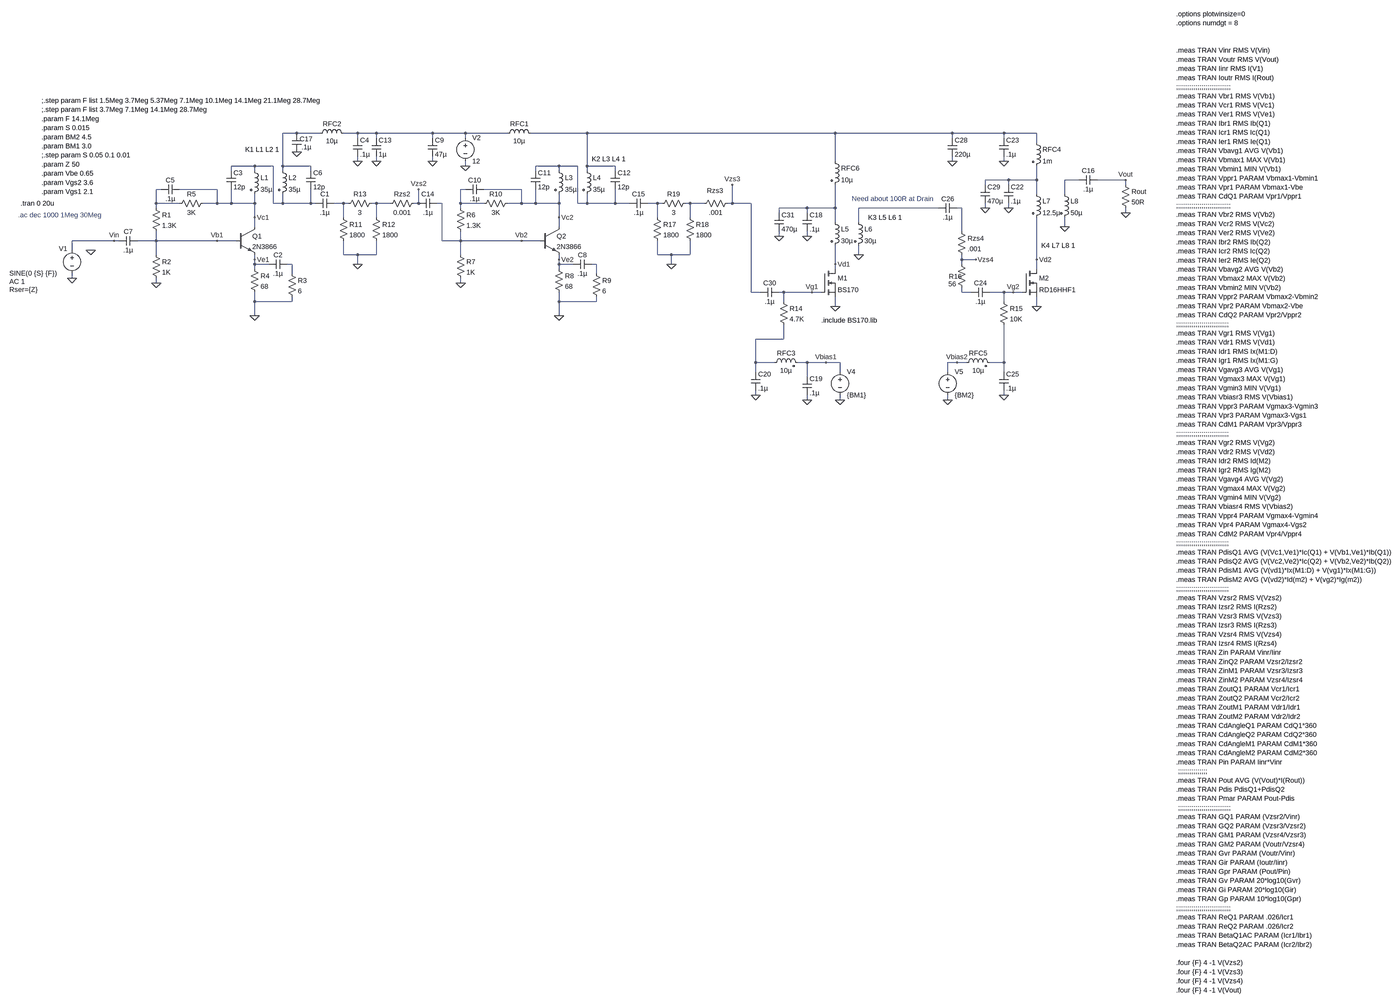
[diagram p0: schematic 2N3866 x2 EMRFD BS170 RD16HHF1.asc, whole sheet]
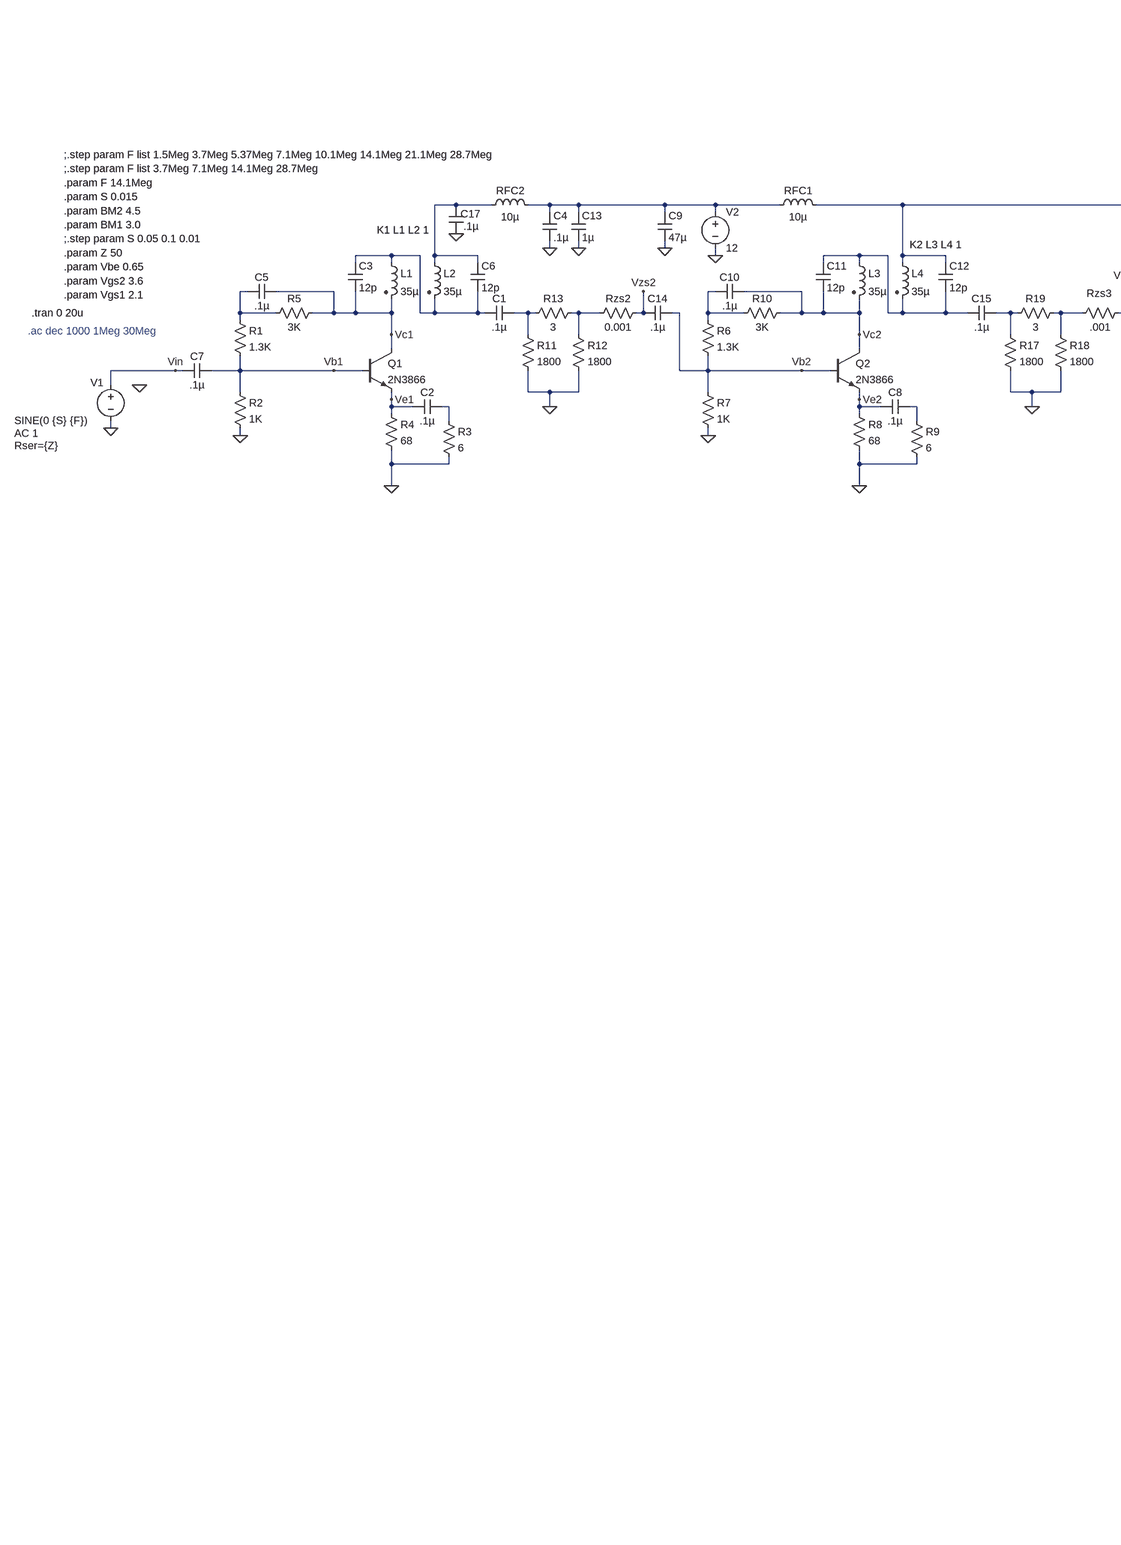
[diagram p1: schematic 2N3866 x2 EMRFD BS170 RD16HHF1.asc, part, row 1 of 1, column 1 of 2]
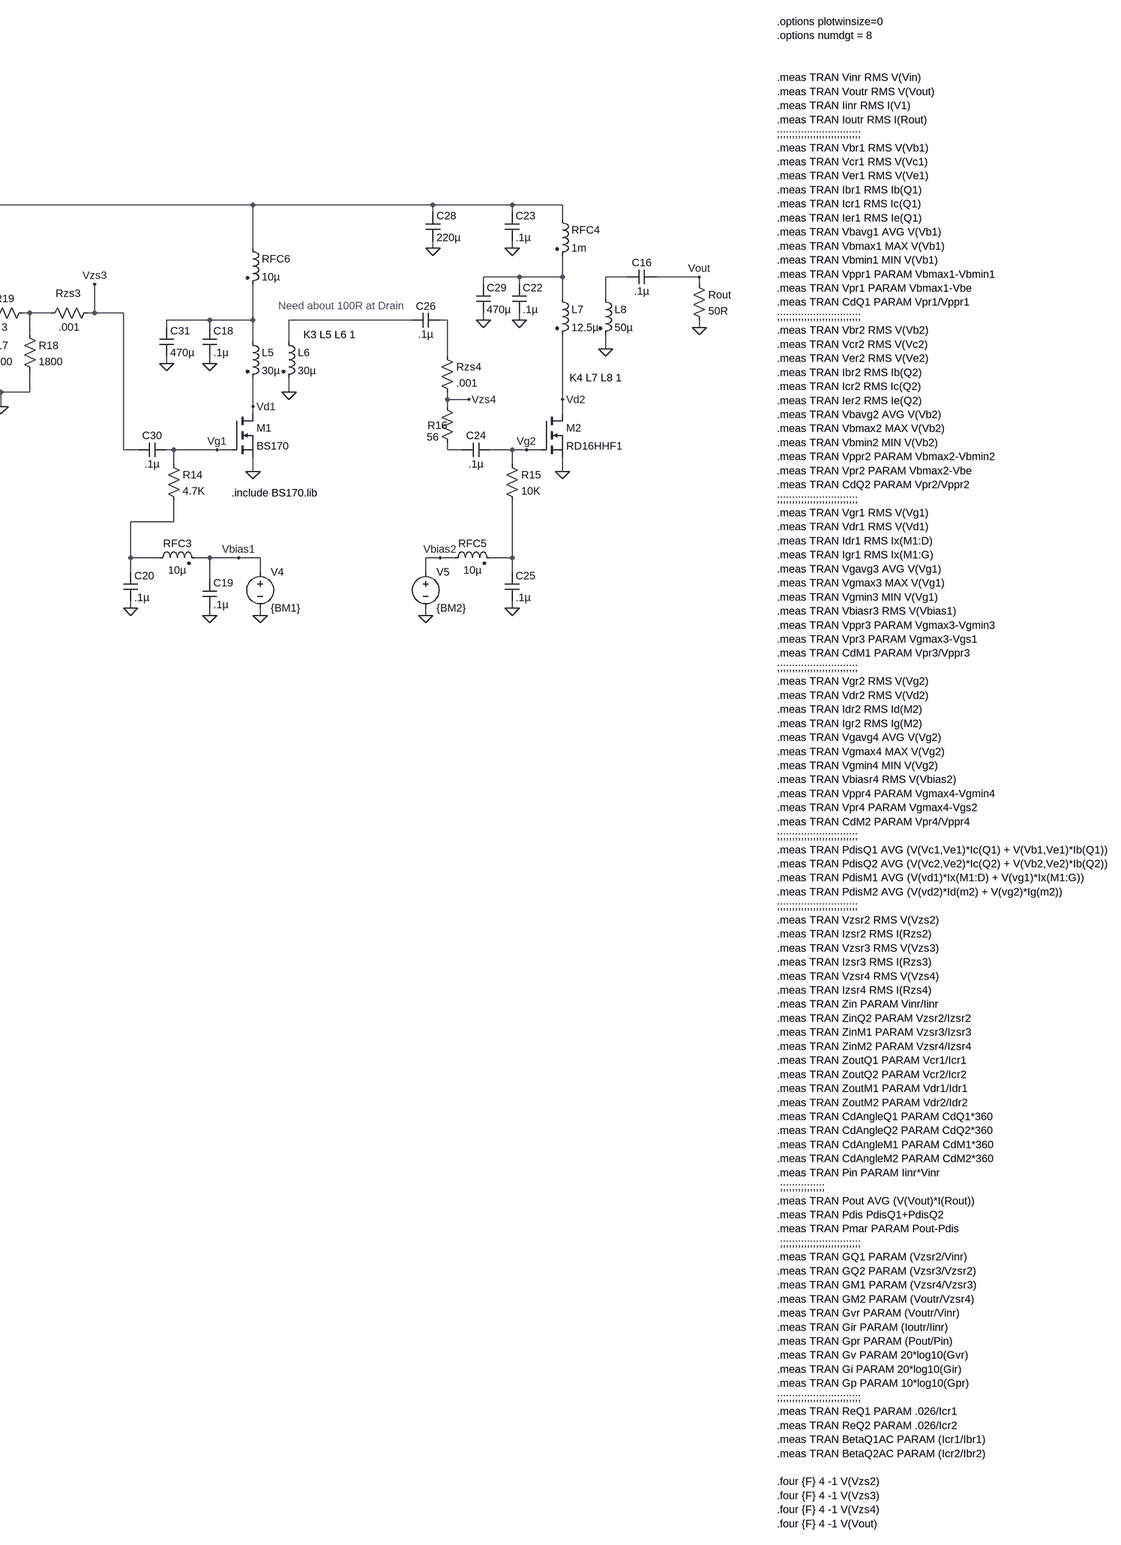
[diagram p2: schematic 2N3866 x2 EMRFD BS170 RD16HHF1.asc, part, row 1 of 1, column 2 of 2]
2N3866 x2 EMRFD BS170 RD16HHF1.asc, the LTspice schematic file:
Version 4
SHEET 1 5068 2428
WIRE 560 -176 512 -176
WIRE 640 -176 560 -176
WIRE 768 -176 720 -176
WIRE 832 -176 768 -176
WIRE 1024 -176 832 -176
WIRE 1136 -176 1024 -176
WIRE 1280 -176 1136 -176
WIRE 1552 -176 1360 -176
WIRE 2400 -176 1552 -176
WIRE 2800 -176 2400 -176
WIRE 2976 -176 2800 -176
WIRE 3088 -176 2976 -176
WIRE 768 -160 768 -176
WIRE 832 -160 832 -176
WIRE 1024 -160 1024 -176
WIRE 1136 -160 1136 -176
WIRE 2800 -160 2800 -176
WIRE 2976 -160 2976 -176
WIRE 3088 -144 3088 -176
WIRE 768 -80 768 -96
WIRE 832 -80 832 -96
WIRE 1024 -80 1024 -96
WIRE 2400 -80 2400 -176
WIRE 2800 -80 2800 -96
WIRE 2976 -80 2976 -96
WIRE 416 -64 336 -64
WIRE 480 -64 416 -64
WIRE 512 -64 512 -176
WIRE 608 -64 512 -64
WIRE 1136 -64 1136 -80
WIRE 1456 -64 1376 -64
WIRE 1520 -64 1456 -64
WIRE 1552 -64 1552 -176
WIRE 1648 -64 1552 -64
WIRE 336 -48 336 -64
WIRE 416 -48 416 -64
WIRE 512 -48 512 -64
WIRE 608 -48 608 -64
WIRE 1376 -48 1376 -64
WIRE 1456 -48 1456 -64
WIRE 1552 -48 1552 -64
WIRE 1648 -48 1648 -64
WIRE 2992 -16 2912 -16
WIRE 3088 -16 3088 -64
WIRE 3088 -16 2992 -16
WIRE 3232 -16 3184 -16
WIRE 3392 -16 3296 -16
WIRE 2912 0 2912 -16
WIRE 2992 0 2992 -16
WIRE 3392 0 3392 -16
WIRE 96 16 80 16
WIRE 288 16 160 16
WIRE 1136 16 1120 16
WIRE 1328 16 1200 16
WIRE 3088 32 3088 -16
WIRE 3184 32 3184 -16
WIRE 80 64 80 16
WIRE 160 64 80 64
WIRE 288 64 288 16
WIRE 288 64 240 64
WIRE 336 64 336 16
WIRE 336 64 288 64
WIRE 416 64 416 32
WIRE 416 64 336 64
WIRE 480 64 480 -64
WIRE 512 64 512 32
WIRE 512 64 480 64
WIRE 608 64 608 16
WIRE 608 64 512 64
WIRE 624 64 608 64
WIRE 720 64 688 64
WIRE 736 64 720 64
WIRE 832 64 816 64
WIRE 880 64 832 64
WIRE 976 64 976 16
WIRE 976 64 960 64
WIRE 1056 64 1040 64
WIRE 1120 64 1120 16
WIRE 1200 64 1120 64
WIRE 1328 64 1328 16
WIRE 1328 64 1280 64
WIRE 1376 64 1376 16
WIRE 1376 64 1328 64
WIRE 1456 64 1456 32
WIRE 1456 64 1376 64
WIRE 1520 64 1520 -64
WIRE 1552 64 1552 32
WIRE 1552 64 1520 64
WIRE 1648 64 1648 16
WIRE 1648 64 1552 64
WIRE 1696 64 1648 64
WIRE 1792 64 1760 64
WIRE 1808 64 1792 64
WIRE 1904 64 1888 64
WIRE 1952 64 1904 64
WIRE 2048 64 2048 0
WIRE 2048 64 2032 64
WIRE 2112 64 2048 64
WIRE 80 80 80 64
WIRE 1120 80 1120 64
WIRE 2304 80 2208 80
WIRE 2400 80 2400 0
WIRE 2400 80 2304 80
WIRE 2752 80 2480 80
WIRE 2832 80 2816 80
WIRE 2912 80 2912 64
WIRE 2992 80 2992 64
WIRE 2208 96 2208 80
WIRE 2304 96 2304 80
WIRE 3392 96 3392 80
WIRE 416 112 416 64
WIRE 720 112 720 64
WIRE 832 112 832 64
WIRE 1456 112 1456 64
WIRE 1792 112 1792 64
WIRE 1904 112 1904 64
WIRE 2400 128 2400 80
WIRE 2480 128 2480 80
WIRE 416 144 416 112
WIRE 1456 144 1456 112
WIRE 3184 144 3184 112
WIRE 2832 160 2832 80
WIRE 2208 176 2208 160
WIRE 2304 176 2304 160
WIRE -64 192 -208 192
WIRE -48 192 -64 192
WIRE 80 192 80 160
WIRE 80 192 16 192
WIRE 288 192 80 192
WIRE 352 192 288 192
WIRE 1056 192 1056 64
WIRE 1120 192 1120 160
WIRE 1120 192 1056 192
WIRE 1328 192 1120 192
WIRE 1392 192 1328 192
WIRE -208 224 -208 192
WIRE 80 240 80 192
WIRE 720 240 720 192
WIRE 768 240 720 240
WIRE 832 240 832 192
WIRE 832 240 768 240
WIRE 1120 240 1120 192
WIRE 1792 240 1792 192
WIRE 1840 240 1792 240
WIRE 1904 240 1904 192
WIRE 1904 240 1840 240
WIRE 2480 240 2480 208
WIRE 416 256 416 240
WIRE 1456 256 1456 240
WIRE 2832 256 2832 240
WIRE 2880 256 2832 256
WIRE 3088 256 3088 112
WIRE 416 272 416 256
WIRE 464 272 416 272
WIRE 544 272 528 272
WIRE 768 272 768 240
WIRE 1456 272 1456 256
WIRE 1504 272 1456 272
WIRE 1584 272 1568 272
WIRE 1840 272 1840 240
WIRE 2400 272 2400 208
WIRE 2832 272 2832 256
WIRE 416 288 416 272
WIRE 1456 288 1456 272
WIRE 2400 288 2400 272
WIRE 3088 288 3088 256
WIRE 544 304 544 272
WIRE 1584 304 1584 272
WIRE -208 320 -208 304
WIRE 80 336 80 320
WIRE 1120 336 1120 320
WIRE 2112 368 2112 64
WIRE 2144 368 2112 368
WIRE 2224 368 2208 368
WIRE 2320 368 2224 368
WIRE 2352 368 2320 368
WIRE 2832 368 2832 352
WIRE 2864 368 2832 368
WIRE 2976 368 2928 368
WIRE 3008 368 2976 368
WIRE 3040 368 3008 368
WIRE 416 400 416 368
WIRE 544 400 544 384
WIRE 544 400 416 400
WIRE 1456 400 1456 368
WIRE 1584 400 1584 384
WIRE 1584 400 1456 400
WIRE 2224 400 2224 368
WIRE 2976 400 2976 368
WIRE 2400 416 2400 384
WIRE 3088 416 3088 384
WIRE 416 448 416 400
WIRE 1456 448 1456 400
WIRE 2224 528 2224 480
WIRE 2224 528 2128 528
WIRE 2128 608 2128 528
WIRE 2192 608 2128 608
WIRE 2304 608 2272 608
WIRE 2368 608 2304 608
WIRE 2416 608 2368 608
WIRE 2816 608 2784 608
WIRE 2848 608 2816 608
WIRE 2976 608 2976 480
WIRE 2976 608 2928 608
WIRE 2128 640 2128 608
WIRE 2416 640 2416 608
WIRE 2784 640 2784 608
WIRE 2976 640 2976 608
WIRE 2304 656 2304 608
WIRE 2128 720 2128 704
WIRE 2976 720 2976 704
WIRE 2304 736 2304 720
WIRE 2416 736 2416 720
WIRE 2784 736 2784 720
FLAG -208 320 0
FLAG 80 336 0
FLAG 416 448 0
FLAG 3392 -16 Vout
FLAG 3392 96 0
FLAG 288 192 Vb1
FLAG 416 256 Ve1
FLAG -64 192 Vin
FLAG 416 112 Vc1
FLAG -144 224 0
FLAG 768 -80 0
FLAG 1120 336 0
FLAG 1456 448 0
FLAG 1328 192 Vb2
FLAG 1456 256 Ve2
FLAG 1456 112 Vc2
FLAG 1136 -64 0
FLAG 1024 -80 0
FLAG 832 -80 0
FLAG 768 272 0
FLAG 560 -112 0
FLAG 976 16 Vzs2
FLAG 2400 416 0
FLAG 2320 368 Vg1
FLAG 2400 272 Vd1
FLAG 2304 176 0
FLAG 2304 736 0
FLAG 2128 720 0
FLAG 2416 736 0
FLAG 2368 608 Vbias1
FLAG 2480 240 0
FLAG 3088 416 0
FLAG 3008 368 Vg2
FLAG 3088 256 Vd2
FLAG 2992 80 0
FLAG 2976 -80 0
FLAG 3184 144 0
FLAG 2976 720 0
FLAG 2880 256 Vzs4
FLAG 2784 736 0
FLAG 2816 608 Vbias2
FLAG 2048 0 Vzs3
FLAG 2800 -80 0
FLAG 2912 80 0
FLAG 2208 176 0
FLAG 1840 272 0
SYMBOL voltage -208 208 R0
WINDOW 0 -45 11 Left 2
WINDOW 3 -214 95 Left 2
WINDOW 123 -214 123 Left 2
WINDOW 39 -214 151 Left 2
SYMATTR InstName V1
SYMATTR Value SINE(0 {S} {F})
SYMATTR Value2 AC 1
SYMATTR SpiceLine Rser={Z}
SYMBOL res 64 64 R0
SYMATTR InstName R1
SYMATTR Value 1.3K
SYMBOL res 64 224 R0
SYMATTR InstName R2
SYMATTR Value 1K
SYMBOL res 400 272 R0
SYMATTR InstName R4
SYMATTR Value 68
SYMBOL ind2 400 -64 R0
SYMATTR InstName L1
SYMATTR Value 35µ
SYMATTR Type ind
SYMBOL res 3376 -16 R0
SYMATTR InstName Rout
SYMATTR Value 50R
SYMBOL cap 16 176 R90
WINDOW 0 0 32 VBottom 2
WINDOW 3 32 32 VTop 2
SYMATTR InstName C7
SYMATTR Value .1µ
SYMBOL ind2 496 -64 R0
SYMATTR InstName L2
SYMATTR Value 35µ
SYMATTR Type ind
SYMBOL npn 352 144 R0
SYMATTR InstName Q1
SYMATTR Value 2N3866
SYMBOL cap 688 48 R90
WINDOW 0 0 32 VBottom 2
WINDOW 3 32 32 VTop 2
SYMATTR InstName C1
SYMATTR Value .1µ
SYMBOL cap 528 256 R90
WINDOW 0 0 32 VBottom 2
WINDOW 3 32 32 VTop 2
SYMATTR InstName C2
SYMATTR Value .1µ
SYMBOL res 528 288 R0
SYMATTR InstName R3
SYMATTR Value 6
SYMBOL res 256 48 R90
WINDOW 0 0 56 VBottom 2
WINDOW 3 32 56 VTop 2
SYMATTR InstName R5
SYMATTR Value 3K
SYMBOL cap 160 0 R90
WINDOW 0 0 32 VBottom 2
WINDOW 3 32 32 VTop 2
SYMATTR InstName C5
SYMATTR Value .1µ
SYMBOL cap 320 -48 R0
SYMATTR InstName C3
SYMATTR Value 12p
SYMBOL cap 592 -48 R0
SYMATTR InstName C6
SYMATTR Value 12p
SYMBOL cap 752 -160 R0
SYMATTR InstName C4
SYMATTR Value .1µ
SYMBOL res 1104 64 R0
SYMATTR InstName R6
SYMATTR Value 1.3K
SYMBOL res 1104 224 R0
SYMATTR InstName R7
SYMATTR Value 1K
SYMBOL res 1440 272 R0
SYMATTR InstName R8
SYMATTR Value 68
SYMBOL ind2 1440 -64 R0
SYMATTR InstName L3
SYMATTR Value 35µ
SYMATTR Type ind
SYMBOL ind2 1536 -64 R0
SYMATTR InstName L4
SYMATTR Value 35µ
SYMATTR Type ind
SYMBOL npn 1392 144 R0
SYMATTR InstName Q2
SYMATTR Value 2N3866
SYMBOL voltage 1136 -176 R0
WINDOW 123 0 0 Left 0
WINDOW 39 0 0 Left 0
SYMATTR InstName V2
SYMATTR Value 12
SYMBOL cap 1568 256 R90
WINDOW 0 0 32 VBottom 2
WINDOW 3 32 32 VTop 2
SYMATTR InstName C8
SYMATTR Value .1µ
SYMBOL res 1568 288 R0
SYMATTR InstName R9
SYMATTR Value 6
SYMBOL cap 1008 -160 R0
SYMATTR InstName C9
SYMATTR Value 47µ
SYMBOL res 1296 48 R90
WINDOW 0 0 56 VBottom 2
WINDOW 3 32 56 VTop 2
SYMATTR InstName R10
SYMATTR Value 3K
SYMBOL cap 1200 0 R90
WINDOW 0 0 32 VBottom 2
WINDOW 3 32 32 VTop 2
SYMATTR InstName C10
SYMATTR Value .1µ
SYMBOL cap 1360 -48 R0
SYMATTR InstName C11
SYMATTR Value 12p
SYMBOL cap 1632 -48 R0
SYMATTR InstName C12
SYMATTR Value 12p
SYMBOL cap 816 -160 R0
SYMATTR InstName C13
SYMATTR Value 1µ
SYMBOL res 704 96 R0
SYMATTR InstName R11
SYMATTR Value 1800
SYMBOL res 816 96 R0
SYMATTR InstName R12
SYMATTR Value 1800
SYMBOL res 832 48 R90
WINDOW 0 0 56 VBottom 2
WINDOW 3 32 56 VTop 2
SYMATTR InstName R13
SYMATTR Value 3
SYMBOL cap 1040 48 R90
WINDOW 0 0 32 VBottom 2
WINDOW 3 32 32 VTop 2
SYMATTR InstName C14
SYMATTR Value .1µ
SYMBOL cap 1760 48 R90
WINDOW 0 0 32 VBottom 2
WINDOW 3 32 32 VTop 2
SYMATTR InstName C15
SYMATTR Value .1µ
SYMBOL ind 1264 -160 R270
WINDOW 0 32 56 VTop 2
WINDOW 3 5 56 VBottom 2
SYMATTR InstName RFC1
SYMATTR Value 10µ
SYMBOL ind 624 -160 R270
WINDOW 0 32 56 VTop 2
WINDOW 3 5 56 VBottom 2
SYMATTR InstName RFC2
SYMATTR Value 10µ
SYMBOL cap 544 -176 R0
WINDOW 0 26 20 Left 2
WINDOW 3 32 47 Left 2
SYMATTR InstName C17
SYMATTR Value .1µ
SYMBOL res 976 48 R90
WINDOW 0 0 56 VBottom 2
WINDOW 3 32 56 VTop 2
SYMATTR InstName Rzs2
SYMATTR Value 0.001
SYMBOL ind2 2384 112 R0
SYMATTR InstName L5
SYMATTR Value 30µ
SYMATTR Type ind
SYMBOL res 2208 384 R0
SYMATTR InstName R14
SYMATTR Value 4.7K
SYMBOL cap 2288 96 R0
SYMATTR InstName C18
SYMATTR Value .1µ
SYMBOL ind2 2176 624 R270
WINDOW 0 32 56 VTop 2
WINDOW 3 4 56 VBottom 2
SYMATTR InstName RFC3
SYMATTR Value 10µ
SYMATTR Type ind
SYMBOL cap 2288 656 R0
SYMATTR InstName C19
SYMATTR Value .1µ
SYMBOL cap 2112 640 R0
SYMATTR InstName C20
SYMATTR Value .1µ
SYMBOL voltage 2416 624 R0
WINDOW 123 0 0 Left 2
WINDOW 39 0 0 Left 2
SYMATTR InstName V4
SYMATTR Value {BM1}
SYMBOL ind2 2464 112 R0
SYMATTR InstName L6
SYMATTR Value 30µ
SYMATTR Type ind
SYMBOL nmos 3040 288 R0
SYMATTR InstName M2
SYMATTR Value RD16HHF1
SYMBOL ind2 3072 16 R0
SYMATTR InstName L7
SYMATTR Value 12.5µ
SYMATTR Type ind
SYMBOL ind2 3072 -160 R0
SYMATTR InstName RFC4
SYMATTR Value 1m
SYMATTR Type ind
SYMBOL cap 2976 0 R0
SYMATTR InstName C22
SYMATTR Value .1µ
SYMBOL ind2 3168 16 R0
SYMATTR InstName L8
SYMATTR Value 50µ
SYMATTR Type ind
SYMBOL cap 2960 -160 R0
SYMATTR InstName C23
SYMATTR Value .1µ
SYMBOL res 2816 144 R0
SYMATTR InstName Rzs4
SYMATTR Value .001
SYMBOL cap 2928 352 R90
WINDOW 0 0 32 VBottom 2
WINDOW 3 32 32 VTop 2
SYMATTR InstName C24
SYMATTR Value .1µ
SYMBOL res 2960 384 R0
SYMATTR InstName R15
SYMATTR Value 10K
SYMBOL ind2 2832 624 R270
WINDOW 0 32 56 VTop 2
WINDOW 3 4 56 VBottom 2
SYMATTR InstName RFC5
SYMATTR Value 10µ
SYMATTR Type ind
SYMBOL cap 2960 640 R0
SYMATTR InstName C25
SYMATTR Value .1µ
SYMBOL cap 2752 96 R270
WINDOW 0 32 32 VTop 2
WINDOW 3 0 32 VBottom 2
SYMATTR InstName C26
SYMATTR Value .1µ
SYMBOL voltage 2784 624 R0
WINDOW 123 0 0 Left 2
WINDOW 39 0 0 Left 2
SYMATTR InstName V5
SYMATTR Value {BM2}
SYMBOL res 2048 48 R90
WINDOW 0 -12 59 VBottom 2
WINDOW 3 32 56 VTop 2
SYMATTR InstName Rzs3
SYMATTR Value .001
SYMBOL cap 2784 -160 R0
SYMATTR InstName C28
SYMATTR Value 220µ
SYMBOL cap 2896 0 R0
SYMATTR InstName C29
SYMATTR Value 470µ
SYMBOL res 2816 256 R0
WINDOW 0 -28 58 Left 2
WINDOW 3 -30 84 Left 2
SYMATTR InstName R16
SYMATTR Value 56
SYMBOL cap 2144 384 R270
WINDOW 0 32 32 VTop 2
WINDOW 3 0 32 VBottom 2
SYMATTR InstName C30
SYMATTR Value .1µ
SYMBOL nmos 2352 288 R0
SYMATTR InstName M1
SYMATTR Value BS170
SYMATTR Prefix X
SYMBOL ind2 2384 -96 R0
SYMATTR InstName RFC6
SYMATTR Value 10µ
SYMATTR Type ind
SYMBOL cap 2192 96 R0
SYMATTR InstName C31
SYMATTR Value 470µ
SYMBOL cap 3296 -32 R90
WINDOW 0 0 32 VBottom 2
WINDOW 3 32 32 VTop 2
SYMATTR InstName C16
SYMATTR Value .1µ
SYMBOL res 1776 96 R0
SYMATTR InstName R17
SYMATTR Value 1800
SYMBOL res 1888 96 R0
SYMATTR InstName R18
SYMATTR Value 1800
SYMBOL res 1904 48 R90
WINDOW 0 0 56 VBottom 2
WINDOW 3 32 56 VTop 2
SYMATTR InstName R19
SYMATTR Value 3
TEXT -384 64 Left 2 !.tran 0 20u
TEXT 3736 -584 Left 2 !.options plotwinsize=0\n.options numdgt = 8\n \n \n.meas TRAN Vinr RMS V(Vin)\n.meas TRAN Voutr RMS V(Vout)\n.meas TRAN Iinr RMS I(V1)\n.meas TRAN Ioutr RMS I(Rout)\n;;;;;;;;;;;;;;;;;;;;;;;;;;;;\n.meas TRAN Vbr1 RMS V(Vb1)\n.meas TRAN Vcr1 RMS V(Vc1)\n.meas TRAN Ver1 RMS V(Ve1)\n.meas TRAN Ibr1 RMS Ib(Q1)\n.meas TRAN Icr1 RMS Ic(Q1)\n.meas TRAN Ier1 RMS Ie(Q1)\n.meas TRAN Vbavg1 AVG V(Vb1)\n.meas TRAN Vbmax1 MAX V(Vb1)\n.meas TRAN Vbmin1 MIN V(Vb1)\n.meas TRAN Vppr1 PARAM Vbmax1-Vbmin1\n.meas TRAN Vpr1 PARAM Vbmax1-Vbe\n.meas TRAN CdQ1 PARAM Vpr1/Vppr1\n;;;;;;;;;;;;;;;;;;;;;;;;;;;;\n.meas TRAN Vbr2 RMS V(Vb2)\n.meas TRAN Vcr2 RMS V(Vc2)\n.meas TRAN Ver2 RMS V(Ve2)\n.meas TRAN Ibr2 RMS Ib(Q2)\n.meas TRAN Icr2 RMS Ic(Q2)\n.meas TRAN Ier2 RMS Ie(Q2)\n.meas TRAN Vbavg2 AVG V(Vb2)\n.meas TRAN Vbmax2 MAX V(Vb2)\n.meas TRAN Vbmin2 MIN V(Vb2)\n.meas TRAN Vppr2 PARAM Vbmax2-Vbmin2\n.meas TRAN Vpr2 PARAM Vbmax2-Vbe\n.meas TRAN CdQ2 PARAM Vpr2/Vppr2\n;;;;;;;;;;;;;;;;;;;;;;;;;;;\n.meas TRAN Vgr1 RMS V(Vg1)\n.meas TRAN Vdr1 RMS V(Vd1)\n.meas TRAN Idr1 RMS Ix(M1:D)\n.meas TRAN Igr1 RMS Ix(M1:G)\n.meas TRAN Vgavg3 AVG V(Vg1)\n.meas TRAN Vgmax3 MAX V(Vg1)\n.meas TRAN Vgmin3 MIN V(Vg1)\n.meas TRAN Vbiasr3 RMS V(Vbias1)\n.meas TRAN Vppr3 PARAM Vgmax3-Vgmin3\n.meas TRAN Vpr3 PARAM Vgmax3-Vgs1\n.meas TRAN CdM1 PARAM Vpr3/Vppr3\n;;;;;;;;;;;;;;;;;;;;;;;;;;;\n.meas TRAN Vgr2 RMS V(Vg2)\n.meas TRAN Vdr2 RMS V(Vd2)\n.meas TRAN Idr2 RMS Id(M2)\n.meas TRAN Igr2 RMS Ig(M2)\n.meas TRAN Vgavg4 AVG V(Vg2)\n.meas TRAN Vgmax4 MAX V(Vg2)\n.meas TRAN Vgmin4 MIN V(Vg2)\n.meas TRAN Vbiasr4 RMS V(Vbias2)\n.meas TRAN Vppr4 PARAM Vgmax4-Vgmin4\n.meas TRAN Vpr4 PARAM Vgmax4-Vgs2\n.meas TRAN CdM2 PARAM Vpr4/Vppr4\n;;;;;;;;;;;;;;;;;;;;;;;;;;;\n.meas TRAN PdisQ1 AVG (V(Vc1,Ve1)*Ic(Q1) + V(Vb1,Ve1)*Ib(Q1))\n.meas TRAN PdisQ2 AVG (V(Vc2,Ve2)*Ic(Q2) + V(Vb2,Ve2)*Ib(Q2))\n.meas TRAN PdisM1 AVG (V(vd1)*Ix(M1:D) + V(vg1)*Ix(M1:G))\n.meas TRAN PdisM2 AVG (V(vd2)*Id(m2) + V(vg2)*Ig(m2))\n;;;;;;;;;;;;;;;;;;;;;;;;;;;\n.meas TRAN Vzsr2 RMS V(Vzs2)\n.meas TRAN Izsr2 RMS I(Rzs2)\n.meas TRAN Vzsr3 RMS V(Vzs3)\n.meas TRAN Izsr3 RMS I(Rzs3)\n.meas TRAN Vzsr4 RMS V(Vzs4)\n.meas TRAN Izsr4 RMS I(Rzs4)\n.meas TRAN Zin PARAM Vinr/Iinr\n.meas TRAN ZinQ2 PARAM Vzsr2/Izsr2\n.meas TRAN ZinM1 PARAM Vzsr3/Izsr3\n.meas TRAN ZinM2 PARAM Vzsr4/Izsr4\n.meas TRAN ZoutQ1 PARAM Vcr1/Icr1\n.meas TRAN ZoutQ2 PARAM Vcr2/Icr2\n.meas TRAN ZoutM1 PARAM Vdr1/Idr1\n.meas TRAN ZoutM2 PARAM Vdr2/Idr2\n.meas TRAN CdAngleQ1 PARAM CdQ1*360\n.meas TRAN CdAngleQ2 PARAM CdQ2*360\n.meas TRAN CdAngleM1 PARAM CdM1*360\n.meas TRAN CdAngleM2 PARAM CdM2*360\n.meas TRAN Pin PARAM Iinr*Vinr\n ;;;;;;;;;;;;;;;\n.meas TRAN Pout AVG (V(Vout)*I(Rout))\n.meas TRAN Pdis PdisQ1+PdisQ2\n.meas TRAN Pmar PARAM Pout-Pdis\n ;;;;;;;;;;;;;;;;;;;;;;;;;;;\n.meas TRAN GQ1 PARAM (Vzsr2/Vinr)\n.meas TRAN GQ2 PARAM (Vzsr3/Vzsr2)\n.meas TRAN GM1 PARAM (Vzsr4/Vzsr3)\n.meas TRAN GM2 PARAM (Voutr/Vzsr4)\n.meas TRAN Gvr PARAM (Voutr/Vinr)\n.meas TRAN Gir PARAM (Ioutr/Iinr)\n.meas TRAN Gpr PARAM (Pout/Pin)\n.meas TRAN Gv PARAM 20*log10(Gvr)\n.meas TRAN Gi PARAM 20*log10(Gir)\n.meas TRAN Gp PARAM 10*log10(Gpr)\n;;;;;;;;;;;;;;;;;;;;;;;;;;;;\n.meas TRAN ReQ1 PARAM .026/Icr1\n.meas TRAN ReQ2 PARAM .026/Icr2\n.meas TRAN BetaQ1AC PARAM (Icr1/Ibr1)\n.meas TRAN BetaQ2AC PARAM (Icr2/Ibr2)\n \n.four {F} 4 -1 V(Vzs2)\n.four {F} 4 -1 V(Vzs3)\n.four {F} 4 -1 V(Vzs4)\n.four {F} 4 -1 V(Vout)
TEXT -312 -288 Left 2 !;.step param F list 1.5Meg 3.7Meg 5.37Meg 7.1Meg 10.1Meg 14.1Meg 21.1Meg 28.7Meg\n;.step param F list 3.7Meg 7.1Meg 14.1Meg 28.7Meg\n.param F 14.1Meg\n.param S 0.015\n.param BM2 4.5\n.param BM1 3.0\n;.step param S 0.05 0.1 0.01\n.param Z 50\n.param Vbe 0.65\n.param Vgs2 3.6\n.param Vgs1 2.1
TEXT -392 104 Left 2 ;.ac dec 1000 1Meg 30Meg
TEXT 384 -120 Left 2 !K1 L1 L2 1
TEXT 1568 -88 Left 2 !K2 L3 L4 1
TEXT 2512 112 Left 2 !K3 L5 L6 1
TEXT 3104 208 Left 2 !K4 L7 L8 1
TEXT 2456 48 Left 2 ;Need about 100R at Drain
TEXT 2352 464 Left 2 !.include BS170.lib

The netlist it stands for:
* 2N3866 x2 EMRFD BS170 RD16HHF1.asc
V1 Vin 0 SINE(0 {S} {F}) AC 1 Rser={Z}
R1 N008 Vb1 1.3K
R2 Vb1 0 1K
R4 Ve1 0 68
L1 N004 Vc1 35µ
Rout Vout 0 50R
C7 Vb1 Vin .1µ
L2 N001 N004 35µ
Q1 Vc1 Vb1 Ve1 0 2N3866
C1 N010 N004 .1µ
C2 N017 Ve1 .1µ
R3 N017 0 6
R5 Vc1 N008 3K
C5 Vc1 N008 .1µ
C3 N004 Vc1 12p
C6 N001 N004 12p
C4 N002 0 .1µ
R6 N009 Vb2 1.3K
R7 Vb2 0 1K
R8 Ve2 0 68
L3 N005 Vc2 35µ
L4 N003 N005 35µ
Q2 Vc2 Vb2 Ve2 0 2N3866
V2 N002 0 12
C8 N018 Ve2 .1µ
R9 N018 0 6
C9 N002 0 47µ
R10 Vc2 N009 3K
C10 Vc2 N009 .1µ
C11 N005 Vc2 12p
C12 N003 N005 12p
C13 N002 0 1µ
R11 N010 0 1800
R12 N011 0 1800
R13 N011 N010 3
C14 Vb2 Vzs2 .1µ
C15 N012 N005 .1µ
L§RFC1 N002 N003 10µ
L§RFC2 N001 N002 10µ
C17 N001 0 .1µ
Rzs2 Vzs2 N011 0.001
L5 N014 Vd1 30µ
R14 Vg1 N020 4.7K
C18 N014 0 .1µ
L§RFC3 N020 Vbias1 10µ
C19 Vbias1 0 .1µ
C20 N020 0 .1µ
V4 Vbias1 0 {BM1}
L6 N015 0 30µ
M2 Vd2 Vg2 0 0 RD16HHF1
L7 N006 Vd2 12.5µ
L§RFC4 N003 N006 1m
C22 N006 0 .1µ
L8 N007 0 50µ
C23 N003 0 .1µ
Rzs4 N016 Vzs4 .001
C24 Vg2 N019 .1µ
R15 Vg2 N021 10K
L§RFC5 Vbias2 N021 10µ
C25 N021 0 .1µ
C26 N015 N016 .1µ
V5 Vbias2 0 {BM2}
Rzs3 Vzs3 N013 .001
C28 N003 0 220µ
C29 N006 0 470µ
R16 Vzs4 N019 56
C30 Vzs3 Vg1 .1µ
XM1 Vd1 Vg1 0 BS170  ; pins D G S
L§RFC6 N003 N014 10µ
C31 N014 0 470µ
C16 Vout N007 .1µ
R17 N012 0 1800
R18 N013 0 1800
R19 N013 N012 3
.model NPN NPN
.model PNP PNP
.lib standard.bjt
.model NMOS NMOS
.model PMOS PMOS
.lib standard.mos
.tran 0 20u
.options plotwinsize=0
.options numdgt = 8
.meas TRAN Vinr RMS V(Vin)
.meas TRAN Voutr RMS V(Vout)
.meas TRAN Iinr RMS I(V1)
.meas TRAN Ioutr RMS I(Rout)
;;;;;;;;;;;;;;;;;;;;;;;;;;;;
.meas TRAN Vbr1 RMS V(Vb1)
.meas TRAN Vcr1 RMS V(Vc1)
.meas TRAN Ver1 RMS V(Ve1)
.meas TRAN Ibr1 RMS Ib(Q1)
.meas TRAN Icr1 RMS Ic(Q1)
.meas TRAN Ier1 RMS Ie(Q1)
.meas TRAN Vbavg1 AVG V(Vb1)
.meas TRAN Vbmax1 MAX V(Vb1)
.meas TRAN Vbmin1 MIN V(Vb1)
.meas TRAN Vppr1 PARAM Vbmax1-Vbmin1
.meas TRAN Vpr1 PARAM Vbmax1-Vbe
.meas TRAN CdQ1 PARAM Vpr1/Vppr1
;;;;;;;;;;;;;;;;;;;;;;;;;;;;
.meas TRAN Vbr2 RMS V(Vb2)
.meas TRAN Vcr2 RMS V(Vc2)
.meas TRAN Ver2 RMS V(Ve2)
.meas TRAN Ibr2 RMS Ib(Q2)
.meas TRAN Icr2 RMS Ic(Q2)
.meas TRAN Ier2 RMS Ie(Q2)
.meas TRAN Vbavg2 AVG V(Vb2)
.meas TRAN Vbmax2 MAX V(Vb2)
.meas TRAN Vbmin2 MIN V(Vb2)
.meas TRAN Vppr2 PARAM Vbmax2-Vbmin2
.meas TRAN Vpr2 PARAM Vbmax2-Vbe
.meas TRAN CdQ2 PARAM Vpr2/Vppr2
;;;;;;;;;;;;;;;;;;;;;;;;;;;
.meas TRAN Vgr1 RMS V(Vg1)
.meas TRAN Vdr1 RMS V(Vd1)
.meas TRAN Idr1 RMS Ix(M1:D)
.meas TRAN Igr1 RMS Ix(M1:G)
.meas TRAN Vgavg3 AVG V(Vg1)
.meas TRAN Vgmax3 MAX V(Vg1)
.meas TRAN Vgmin3 MIN V(Vg1)
.meas TRAN Vbiasr3 RMS V(Vbias1)
.meas TRAN Vppr3 PARAM Vgmax3-Vgmin3
.meas TRAN Vpr3 PARAM Vgmax3-Vgs1
.meas TRAN CdM1 PARAM Vpr3/Vppr3
;;;;;;;;;;;;;;;;;;;;;;;;;;;
.meas TRAN Vgr2 RMS V(Vg2)
.meas TRAN Vdr2 RMS V(Vd2)
.meas TRAN Idr2 RMS Id(M2)
.meas TRAN Igr2 RMS Ig(M2)
.meas TRAN Vgavg4 AVG V(Vg2)
.meas TRAN Vgmax4 MAX V(Vg2)
.meas TRAN Vgmin4 MIN V(Vg2)
.meas TRAN Vbiasr4 RMS V(Vbias2)
.meas TRAN Vppr4 PARAM Vgmax4-Vgmin4
.meas TRAN Vpr4 PARAM Vgmax4-Vgs2
.meas TRAN CdM2 PARAM Vpr4/Vppr4
;;;;;;;;;;;;;;;;;;;;;;;;;;;
.meas TRAN PdisQ1 AVG (V(Vc1,Ve1)*Ic(Q1) + V(Vb1,Ve1)*Ib(Q1))
.meas TRAN PdisQ2 AVG (V(Vc2,Ve2)*Ic(Q2) + V(Vb2,Ve2)*Ib(Q2))
.meas TRAN PdisM1 AVG (V(vd1)*Ix(M1:D) + V(vg1)*Ix(M1:G))
.meas TRAN PdisM2 AVG (V(vd2)*Id(m2) + V(vg2)*Ig(m2))
;;;;;;;;;;;;;;;;;;;;;;;;;;;
.meas TRAN Vzsr2 RMS V(Vzs2)
.meas TRAN Izsr2 RMS I(Rzs2)
.meas TRAN Vzsr3 RMS V(Vzs3)
.meas TRAN Izsr3 RMS I(Rzs3)
.meas TRAN Vzsr4 RMS V(Vzs4)
.meas TRAN Izsr4 RMS I(Rzs4)
.meas TRAN Zin PARAM Vinr/Iinr
.meas TRAN ZinQ2 PARAM Vzsr2/Izsr2
.meas TRAN ZinM1 PARAM Vzsr3/Izsr3
.meas TRAN ZinM2 PARAM Vzsr4/Izsr4
.meas TRAN ZoutQ1 PARAM Vcr1/Icr1
.meas TRAN ZoutQ2 PARAM Vcr2/Icr2
.meas TRAN ZoutM1 PARAM Vdr1/Idr1
.meas TRAN ZoutM2 PARAM Vdr2/Idr2
.meas TRAN CdAngleQ1 PARAM CdQ1*360
.meas TRAN CdAngleQ2 PARAM CdQ2*360
.meas TRAN CdAngleM1 PARAM CdM1*360
.meas TRAN CdAngleM2 PARAM CdM2*360
.meas TRAN Pin PARAM Iinr*Vinr
 ;;;;;;;;;;;;;;;
.meas TRAN Pout AVG (V(Vout)*I(Rout))
.meas TRAN Pdis PdisQ1+PdisQ2
.meas TRAN Pmar PARAM Pout-Pdis
 ;;;;;;;;;;;;;;;;;;;;;;;;;;;
.meas TRAN GQ1 PARAM (Vzsr2/Vinr)
.meas TRAN GQ2 PARAM (Vzsr3/Vzsr2)
.meas TRAN GM1 PARAM (Vzsr4/Vzsr3)
.meas TRAN GM2 PARAM (Voutr/Vzsr4)
.meas TRAN Gvr PARAM (Voutr/Vinr)
.meas TRAN Gir PARAM (Ioutr/Iinr)
.meas TRAN Gpr PARAM (Pout/Pin)
.meas TRAN Gv PARAM 20*log10(Gvr)
.meas TRAN Gi PARAM 20*log10(Gir)
.meas TRAN Gp PARAM 10*log10(Gpr)
;;;;;;;;;;;;;;;;;;;;;;;;;;;;
.meas TRAN ReQ1 PARAM .026/Icr1
.meas TRAN ReQ2 PARAM .026/Icr2
.meas TRAN BetaQ1AC PARAM (Icr1/Ibr1)
.meas TRAN BetaQ2AC PARAM (Icr2/Ibr2)
.four {F} 4 -1 V(Vzs2)
.four {F} 4 -1 V(Vzs3)
.four {F} 4 -1 V(Vzs4)
.four {F} 4 -1 V(Vout)
;.step param F list 1.5Meg 3.7Meg 5.37Meg 7.1Meg 10.1Meg 14.1Meg 21.1Meg 28.7Meg
;.step param F list 3.7Meg 7.1Meg 14.1Meg 28.7Meg
.param F 14.1Meg
.param S 0.015
.param BM2 4.5
.param BM1 3.0
;.step param S 0.05 0.1 0.01
.param Z 50
.param Vbe 0.65
.param Vgs2 3.6
.param Vgs1 2.1
* .ac dec 1000 1Meg 30Meg
K1 L1 L2 1
K2 L3 L4 1
K3 L5 L6 1
K4 L7 L8 1
* Need about 100R at Drain
.include BS170.lib
.backanno
.end